# Altium schematic sheet WT2_Power.SchDoc
size A4
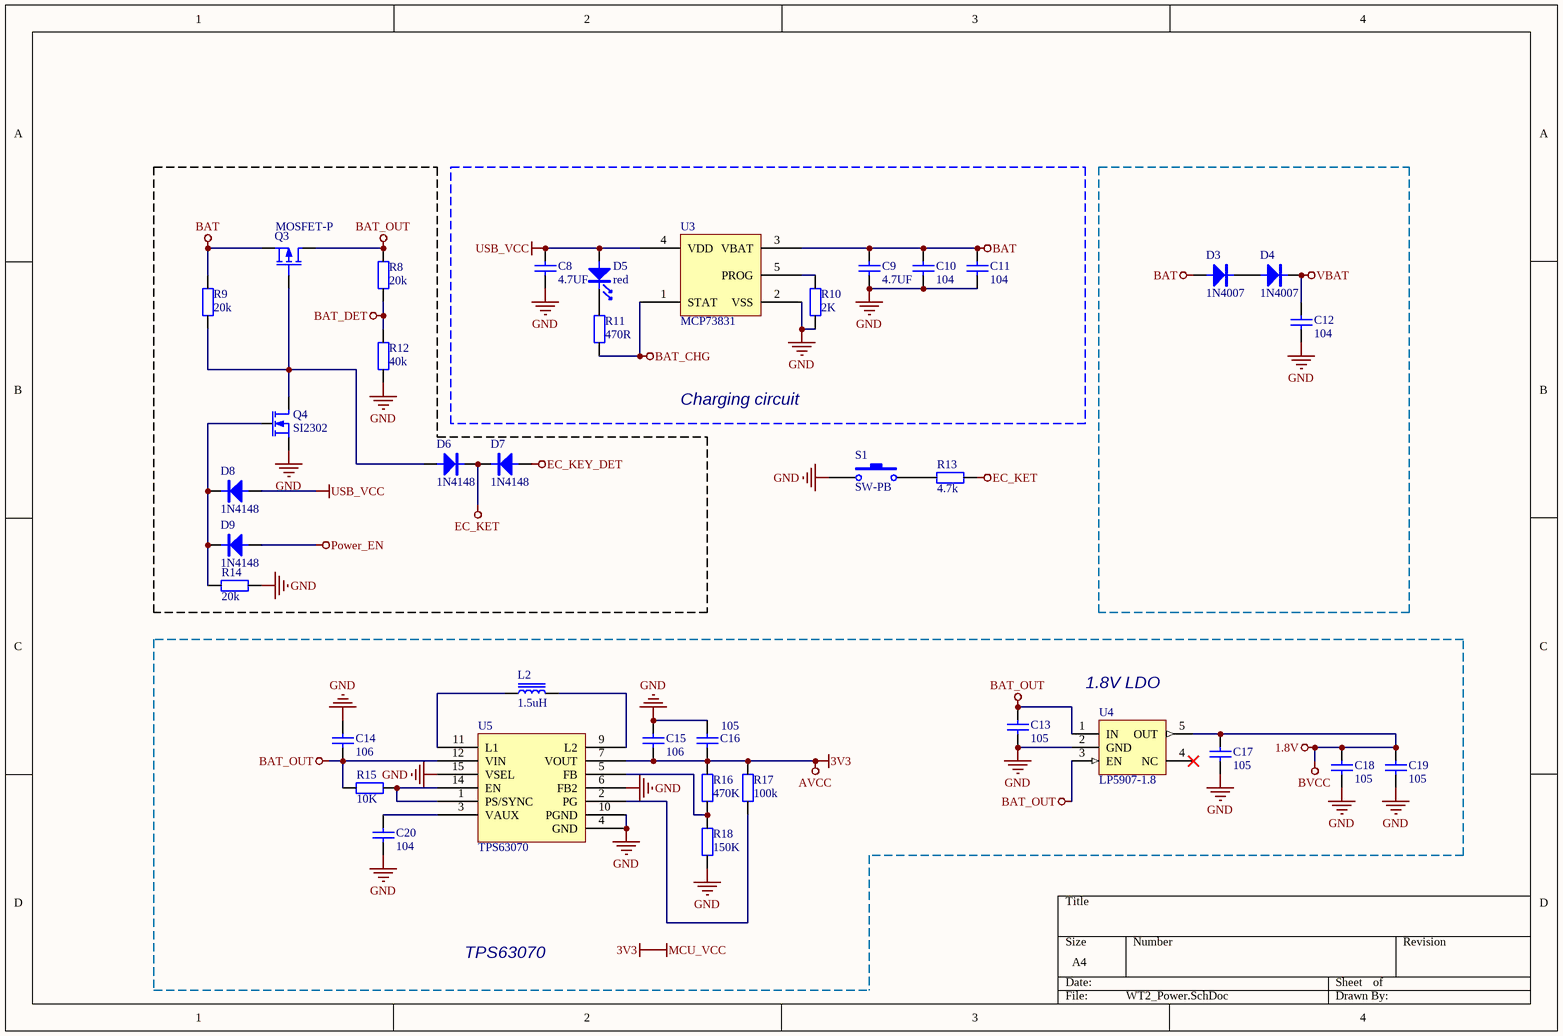
[diagram p0: WT2_Power.SchDoc]

## Parts
C8  4.7UF  [电容_C0805]
C9  4.7UF  [电容_C0805]
C10  104  [电容_C0402]
C11  104  [电容_C0402]
C12  104  [电容_C0402]
C13  105  [电容_C0402]
C14  106  [电容_C0805]
C15  106  [电容_C0603]
C16  105  [电容_C0402]
C17  105  [电容_C0402]
C18  105  [电容_C0402]
C19  105  [电容_C0402]
C20  104  [电容_C0402]
D3  1N4007  [二极管_SOD-323]
D4  1N4007  [二极管_SOD-323]
D5  red  [LED_0603]
D6  1N4148  [二极管_SOD-323]
D7  1N4148  [二极管_SOD-323]
D8  1N4148  [二极管_SOD-323]
D9  1N4148  [二极管_SOD-323]
L2  1.5uH  [变压器电感_0420]
Q3  MOSFET-P  [SOT23]
Q4  SI2302  [MOS_SOT-23]
R8  20k  [电阻_R0402]
R9  20k  [电阻_R0402]
R10  2K  [电阻_R0402]
R11  470R  [电阻_R0402]
R12  40k  [电阻_R0402]
R13  4.7k  [电阻_R0402]
R14  20k  [电阻_R0402]
R15  10K  [电阻_R0402]
R16  470K  [电阻_R0402]
R17  100k  [电阻_R0402]
R18  150K  [电阻_R0402]
S1  SW-PB  [KEY-TE26EA]
U3  MCP73831  [SOT23-5]
U4  LP5907-1.8  [SOT23-5]
U5  TPS63070  [VQFN-15-HR]

## Blocks framed on the sheet
Charging circuit: C8-C11 D5 R10 R11 U3

## Nets
1.8V: C17.2 C18.2 C19.2 U4.5(OUT)  [also labelled BVCC]
3V3: C15.1 C16.1 R16.1 R17.1 U5.7(VOUT)  [also labelled AVCC, MCU_VCC]
BAT: C9.2 C10.1 C11.1 D3.A Q3.3(S) R9.2 U3.3(VBAT)
BAT_CHG: R11.1 U3.1(STAT)
BAT_DET: R8.1 R12.2
BAT_OUT: C13.2 C14.1 Q3.2(D) R8.2 R15.2 U4.1(IN) U4.3(EN) U5.12(VIN)
EC_KET: D6.K D7.K R13.1
EC_KEY_DET: D7.A
GND: C8.1 C9.1 C10.2 C11.2 C12.2 C13.1 C14.2 C15.2 C16.2 C17.1 C18.1 C19.1 C20.1 Q4.3(S) R10.1 R12.1 R14.1 R18.2 S1.1 U3.2(VSS) U4.2(GND) U5.4(GND) U5.6(FB2) U5.10(PGND) U5.15(VSEL)
Power_EN: D9.A
USB_VCC: C8.2 D5.A D8.A U3.4(VDD)
VBAT: C12.1 D4.K
NetC20_2: C20.2 U5.3(VAUX)
NetD3_K: D3.K D4.A
NetD5_K: D5.K R11.2
NetD6_A: D6.A Q3.1(G) Q4.2(D) R9.1
NetD8_K: D8.K D9.K Q4.1(G) R14.2
NetL2_1: L2.1 U5.11(L1)
NetL2_2: L2.2 U5.9(L2)
NetR10_2: R10.2 U3.5(PROG)
NetR13_2: R13.2 S1.2
NetR15_1: R15.1 U5.1(PS/SYNC) U5.14(EN)
NetR16_2: R16.2 R18.1 U5.5(FB)
NetR17_2: R17.2 U5.2(PG)

Not connected (* = marked no-connect by the designer): U4 4(NC)*

## Notes on the sheet
- (near U4) 1.8V LDO
- TPS63070

## Library data of the parts
C8-C20 = cap: U: 50V; 参数: Cap,0805,X7R,104K,50V,125C,±10%
  C8 C9: C: 4.7UF
  C10-C12 C20: C: 104
  C13 C16-C19: C: 105
  C14 C15: C: 106
D3 D4 = Diode: _Specification: Diode,1N4007,SOD-323,1A,40V; _Comma: ,; _Footprint: SOD-323; _Voltage: 40V; _Current: 1A; _Name: Diode; _Model: 1N4007
D5 = LED: 参数: LED,0603,Red
D6-D9 = Diode: _Specification: Diode,1N4148,SOD-323,1A,40V; _Comma: ,; _Footprint: SOD-323; _Voltage: 40V; _Current: 1A; _Name: Diode; _Model: 1N4148
L2 = Inductor Iron 2: _Current: 10A; _Accuracy: 20%; _Footprint: 1040; _Name: IND; _Specification: IND,1040,1.5uH,10A,20%; _Comma: ,; _Value: 1.5uH
Q3 = MOSFET-P: P-Channel MOSFET; Published: 8-Jun-2000; LatestRevisionDate: 17-Jul-2002; LatestRevisionNote: Re-released for DXP Platform.; PackageVersion: 1995/1996; PackageReference: E3; Publisher: Altium Limited; PackageDescription: TO, Flat Index; 3 In-Line, Axial Leads; Body Dia. 4.6mm; Lead Dia. 0.5 mm (max)
Q4 = MOSFET-N: _Comma: ,; _Current: 150A; _Footprint: DFN5*6; _Name: N-MOSFET; _Specification: N-MOSFET,SI2302,DFN5*6,150A,30V; _Voltage: 30V; _Model: SI2302
R8-R18 = Res: P: 1/8W; 参数: Res,0805,0R,±1%,1/8W,100ppm,155C
  R8 R9 R14: R: 20k
  R10: R: 2K
  R11: R: 470R
  R12: R: 40k
  R13: R: 4.7k
  R15: R: 10K
  R16: R: 470K
  R17: R: 100k
  R18: R: 150K
S1 = SW-PB: 按键
U3 = MCP73831: 线性充电管理控制器
U4 = LP5907: LDO
U5 = TPS63070: 降压-升压转换器